# EAGLE schematic board (EAGLE 7.5.0)
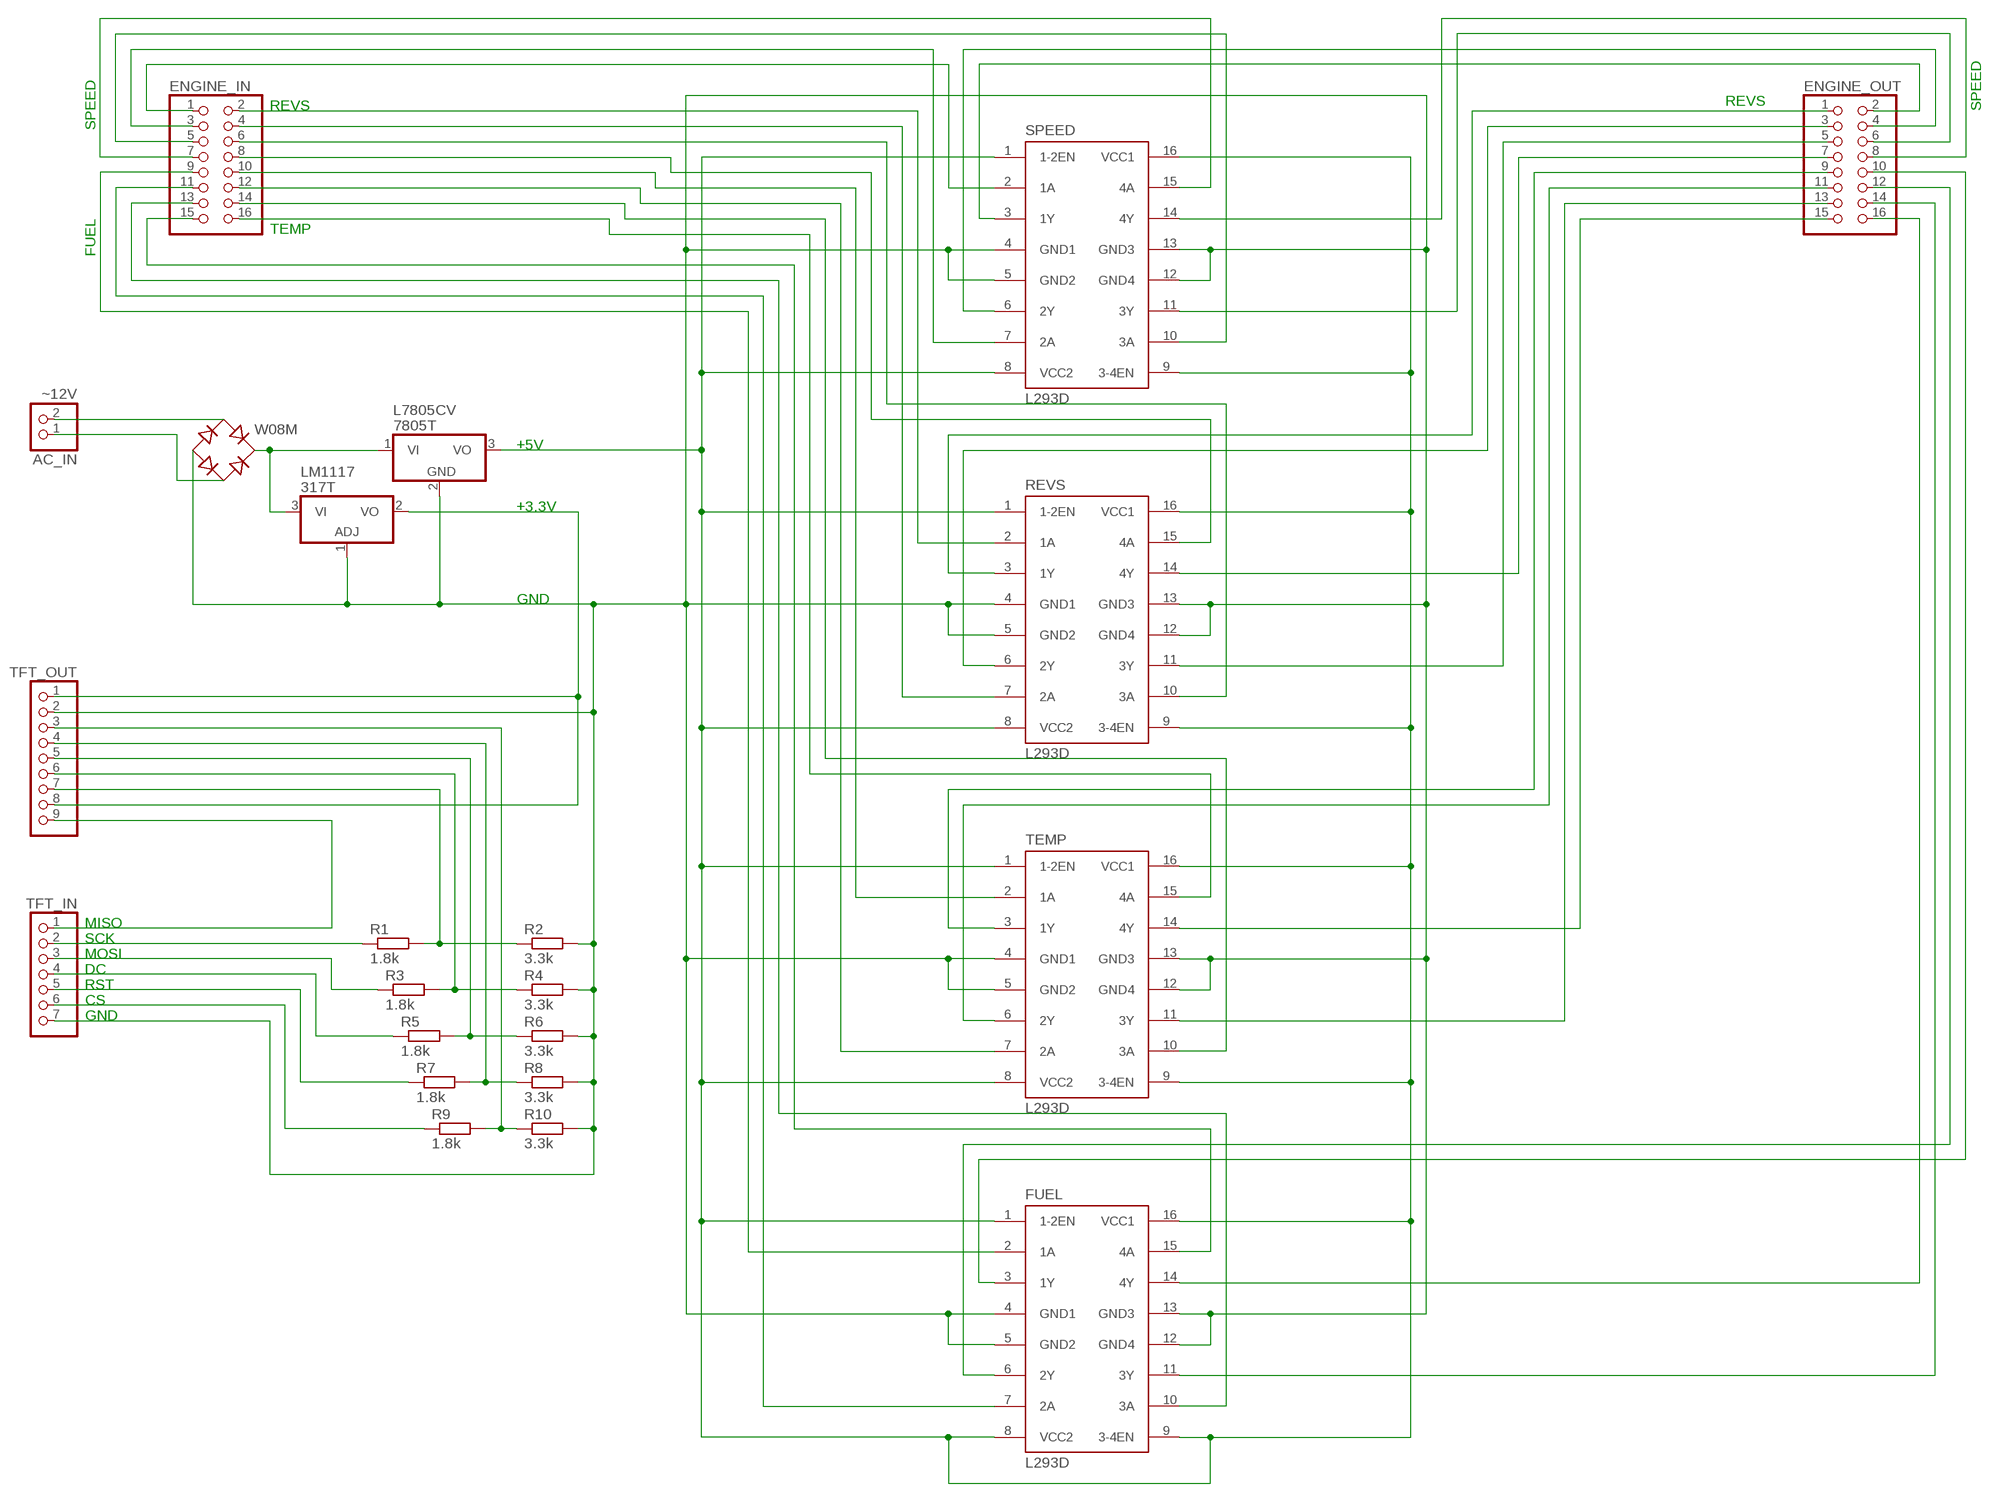
[diagram p0: schematic, sheet 1]

## Parts
AC_IN  ~12V  PINHD-1X2  [1X02]
ENGINE_IN  PINHD-2X8  [2X08]
ENGINE_OUT  PINHD-2X8  [2X08]
FUEL  L293D  [DIL16]
L7805CV  7805T  [TO220H]
LM1117  317T  [TO220H]
R1  1.8k  R-EU_0309/12  [0309/12]
R2  3.3k  R-EU_0309/12  [0309/12]
R3  1.8k  R-EU_0309/12  [0309/12]
R4  3.3k  R-EU_0309/12  [0309/12]
R5  1.8k  R-EU_0309/12  [0309/12]
R6  3.3k  R-EU_0309/12  [0309/12]
R7  1.8k  R-EU_0309/12  [0309/12]
R8  3.3k  R-EU_0309/12  [0309/12]
R9  1.8k  R-EU_0309/12  [0309/12]
R10  3.3k  R-EU_0309/12  [0309/12]
REVS  L293D  [DIL16]
SPEED  L293D  [DIL16]
TEMP  L293D  [DIL16]
TFT_IN  PINHD-1X7  [1X07]
TFT_OUT  PINHD-1X9  [1X09]
W08M  RB1A  [RB1A]

## Nets
+3.3V: LM1117.2(VO) TFT_OUT.1 TFT_OUT.8
+5V: FUEL.1(1-2EN) FUEL.8(VCC2) FUEL.9(3-4EN) FUEL.16(VCC1) L7805CV.3(VO) REVS.1(1-2EN) REVS.8(VCC2) REVS.9(3-4EN) REVS.16(VCC1) SPEED.1(1-2EN) SPEED.8(VCC2) SPEED.9(3-4EN) SPEED.16(VCC1) TEMP.1(1-2EN) TEMP.8(VCC2) TEMP.9(3-4EN) TEMP.16(VCC1)
GND: FUEL.4(GND1) FUEL.5(GND2) FUEL.12(GND4) FUEL.13(GND3) L7805CV.2(GND) LM1117.1(ADJ) R2.2 R4.2 R6.2 R8.2 R10.2 REVS.4(GND1) REVS.5(GND2) REVS.12(GND4) REVS.13(GND3) SPEED.4(GND1) SPEED.5(GND2) SPEED.12(GND4) SPEED.13(GND3) TEMP.4(GND1) TEMP.5(GND2) TEMP.12(GND4) TEMP.13(GND3) TFT_IN.7 TFT_OUT.2 W08M.-
N$1: AC_IN.2 W08M.AC1
N$2: AC_IN.1 W08M.AC2
N$3: ENGINE_IN.1 SPEED.2(1A)
N$4: L7805CV.1(VI) LM1117.3(VI) W08M.+
N$5: R7.2 R8.1 TFT_OUT.4
N$6: R5.2 R6.1 TFT_OUT.5
N$7: R3.2 R4.1 TFT_OUT.6
N$8: ENGINE_IN.3 SPEED.7(2A)
N$9: ENGINE_IN.5 SPEED.10(3A)
N$10: ENGINE_IN.7 SPEED.15(4A)
N$11: ENGINE_IN.2 REVS.2(1A)
N$12: ENGINE_IN.4 REVS.7(2A)
N$13: ENGINE_IN.6 REVS.10(3A)
N$14: ENGINE_IN.8 REVS.15(4A)
N$15: ENGINE_IN.10 TEMP.2(1A)
N$16: ENGINE_IN.12 TEMP.7(2A)
N$17: ENGINE_IN.14 TEMP.10(3A)
N$18: ENGINE_IN.16 TEMP.15(4A)
N$19: ENGINE_IN.9 FUEL.2(1A)
N$20: ENGINE_IN.15 FUEL.15(4A)
N$21: ENGINE_IN.13 FUEL.10(3A)
N$22: ENGINE_IN.11 FUEL.7(2A)
N$23: ENGINE_OUT.4 SPEED.6(2Y)
N$24: ENGINE_OUT.2 SPEED.3(1Y)
N$25: ENGINE_OUT.8 SPEED.14(4Y)
N$26: ENGINE_OUT.6 SPEED.11(3Y)
N$27: ENGINE_OUT.1 REVS.3(1Y)
N$28: ENGINE_OUT.3 REVS.6(2Y)
N$29: ENGINE_OUT.5 REVS.11(3Y)
N$30: ENGINE_OUT.7 REVS.14(4Y)
N$31: ENGINE_OUT.9 TEMP.3(1Y)
N$32: ENGINE_OUT.11 TEMP.6(2Y)
N$33: ENGINE_OUT.13 TEMP.11(3Y)
N$34: ENGINE_OUT.15 TEMP.14(4Y)
N$35: R1.2 R2.1 TFT_OUT.7
N$36: ENGINE_OUT.12 FUEL.6(2Y)
N$37: ENGINE_OUT.10 FUEL.3(1Y)
N$38: ENGINE_OUT.14 FUEL.11(3Y)
N$39: ENGINE_OUT.16 FUEL.14(4Y)
N$41: R9.2 R10.1 TFT_OUT.3
N$42: R9.1 TFT_IN.6
N$43: R7.1 TFT_IN.5
N$44: R5.1 TFT_IN.4
N$45: R3.1 TFT_IN.3
N$46: R1.1 TFT_IN.2
N$47: TFT_IN.1 TFT_OUT.9

## Notes on the sheet
- SPEED
- REVS
- REVS | SPEED
- FUEL
- TEMP
- +5V
- +3.3V
- GND
- MISO
- SCK
- MOSI
- DC
- RST
- CS
- GND

## Library data of the parts
AC_IN = pinhead:PINHD-1X2: PIN HEADER
ENGINE_IN ENGINE_OUT = pinhead:PINHD-2X8: PIN HEADER
FUEL REVS SPEED TEMP = st-microelectronics:L293D: PUSH-PULL 4 CHANNEL DRIVER; MPN: L293D; OC_FARNELL: 9589619; OC_NEWARK: 56P8249
L7805CV = linear:78*: Positive VOLTAGE REGULATOR Source: http://cache.national.com/ds/LM/LM78L05.pdf http://www.fairchildsemi.com/ds/LM/LM7805.pdf
LM1117 = linear:*317: Positive VOLTAGE REGULATOR
R1-R10 = rcl:R-EU_: RESISTOR, European symbol
TFT_IN = pinhead:PINHD-1X7: PIN HEADER
TFT_OUT = pinhead:PINHD-1X9: PIN HEADER
W08M = rectifier:RB1A: RECTIFIER 1 A